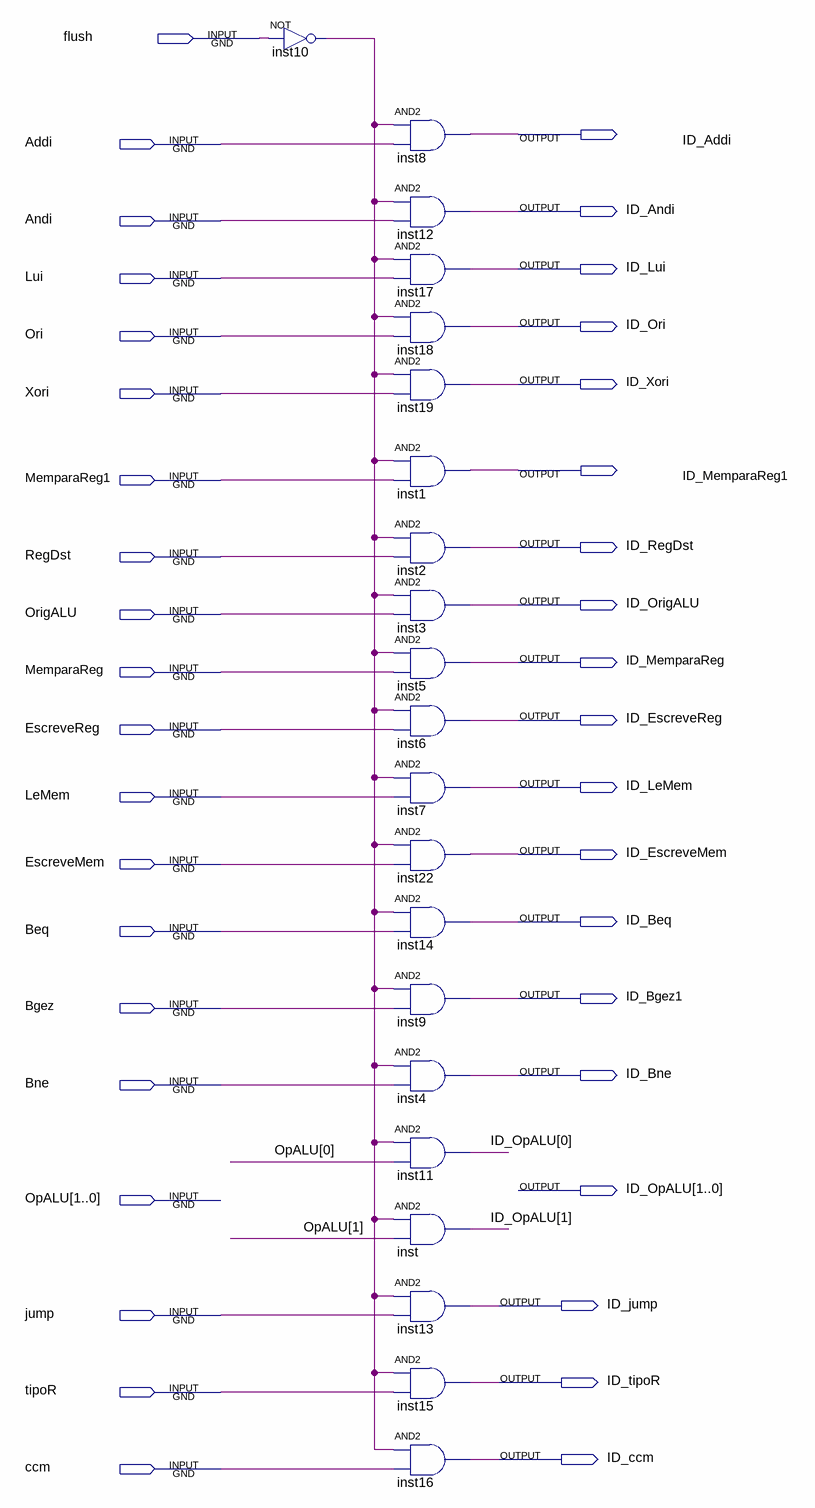
[diagram p0: schematic sheet]
// Quartus schematic flush_Controle.bdf as structural Verilog: 21 symbols, 39 pins
module flush_Controle (
  input  flush,
  input  Addi,
  input  Andi,
  input  Lui,
  input  Ori,
  input  Xori,
  input  MemparaReg1,
  input  RegDst,
  input  OrigALU,
  input  MemparaReg,
  input  EscreveReg,
  input  LeMem,
  input  EscreveMem,
  input  Beq,
  input  Bgez,
  input  Bne,
  input  [1:0] OpALU,
  input  jump,
  input  tipoR,
  input  ccm,
  output ID_Addi,
  output ID_Andi,
  output ID_Lui,
  output ID_Ori,
  output ID_Xori,
  output ID_MemparaReg1,
  output ID_RegDst,
  output ID_OrigALU,
  output ID_MemparaReg,
  output ID_EscreveReg,
  output ID_LeMem,
  output ID_EscreveMem,
  output ID_Beq,
  output ID_Bgez1,
  output ID_Bne,
  output [1:0] ID_OpALU,
  output ID_jump,
  output ID_tipoR,
  output ID_ccm
);

  wire inst10_out;

  not inst10 (inst10_out, flush);
  and inst8 (ID_Addi, inst10_out, Addi);
  and inst12 (ID_Andi, inst10_out, Andi);
  and inst17 (ID_Lui, inst10_out, Lui);
  and inst18 (ID_Ori, inst10_out, Ori);
  and inst19 (ID_Xori, inst10_out, Xori);
  and inst1 (ID_MemparaReg1, inst10_out, MemparaReg1);
  and inst2 (ID_RegDst, inst10_out, RegDst);
  and inst3 (ID_OrigALU, inst10_out, OrigALU);
  and inst5 (ID_MemparaReg, inst10_out, MemparaReg);
  and inst6 (ID_EscreveReg, inst10_out, EscreveReg);
  and inst7 (ID_LeMem, inst10_out, LeMem);
  and inst22 (ID_EscreveMem, inst10_out, EscreveMem);
  and inst14 (ID_Beq, inst10_out, Beq);
  and inst9 (ID_Bgez1, inst10_out, Bgez);
  and inst4 (ID_Bne, inst10_out, Bne);
  and inst11 (ID_OpALU[0], inst10_out, OpALU[0]);
  and inst (ID_OpALU[1], inst10_out, OpALU[1]);
  and inst13 (ID_jump, inst10_out, jump);
  and inst15 (ID_tipoR, inst10_out, tipoR);
  and inst16 (ID_ccm, inst10_out, ccm);
endmodule
